# EasyEDA Pro project eLight_core.epro, schematic Schematic_v2
Board Name: eLight_core2; Create Date: 2024-08-03; Page Name: P1; Project Name: eLight_core; Schematic Name: Schematic2; Update Date: 2024-08-04; Company: 嘉立创EDA; Page Size: A4; Version: V1.0
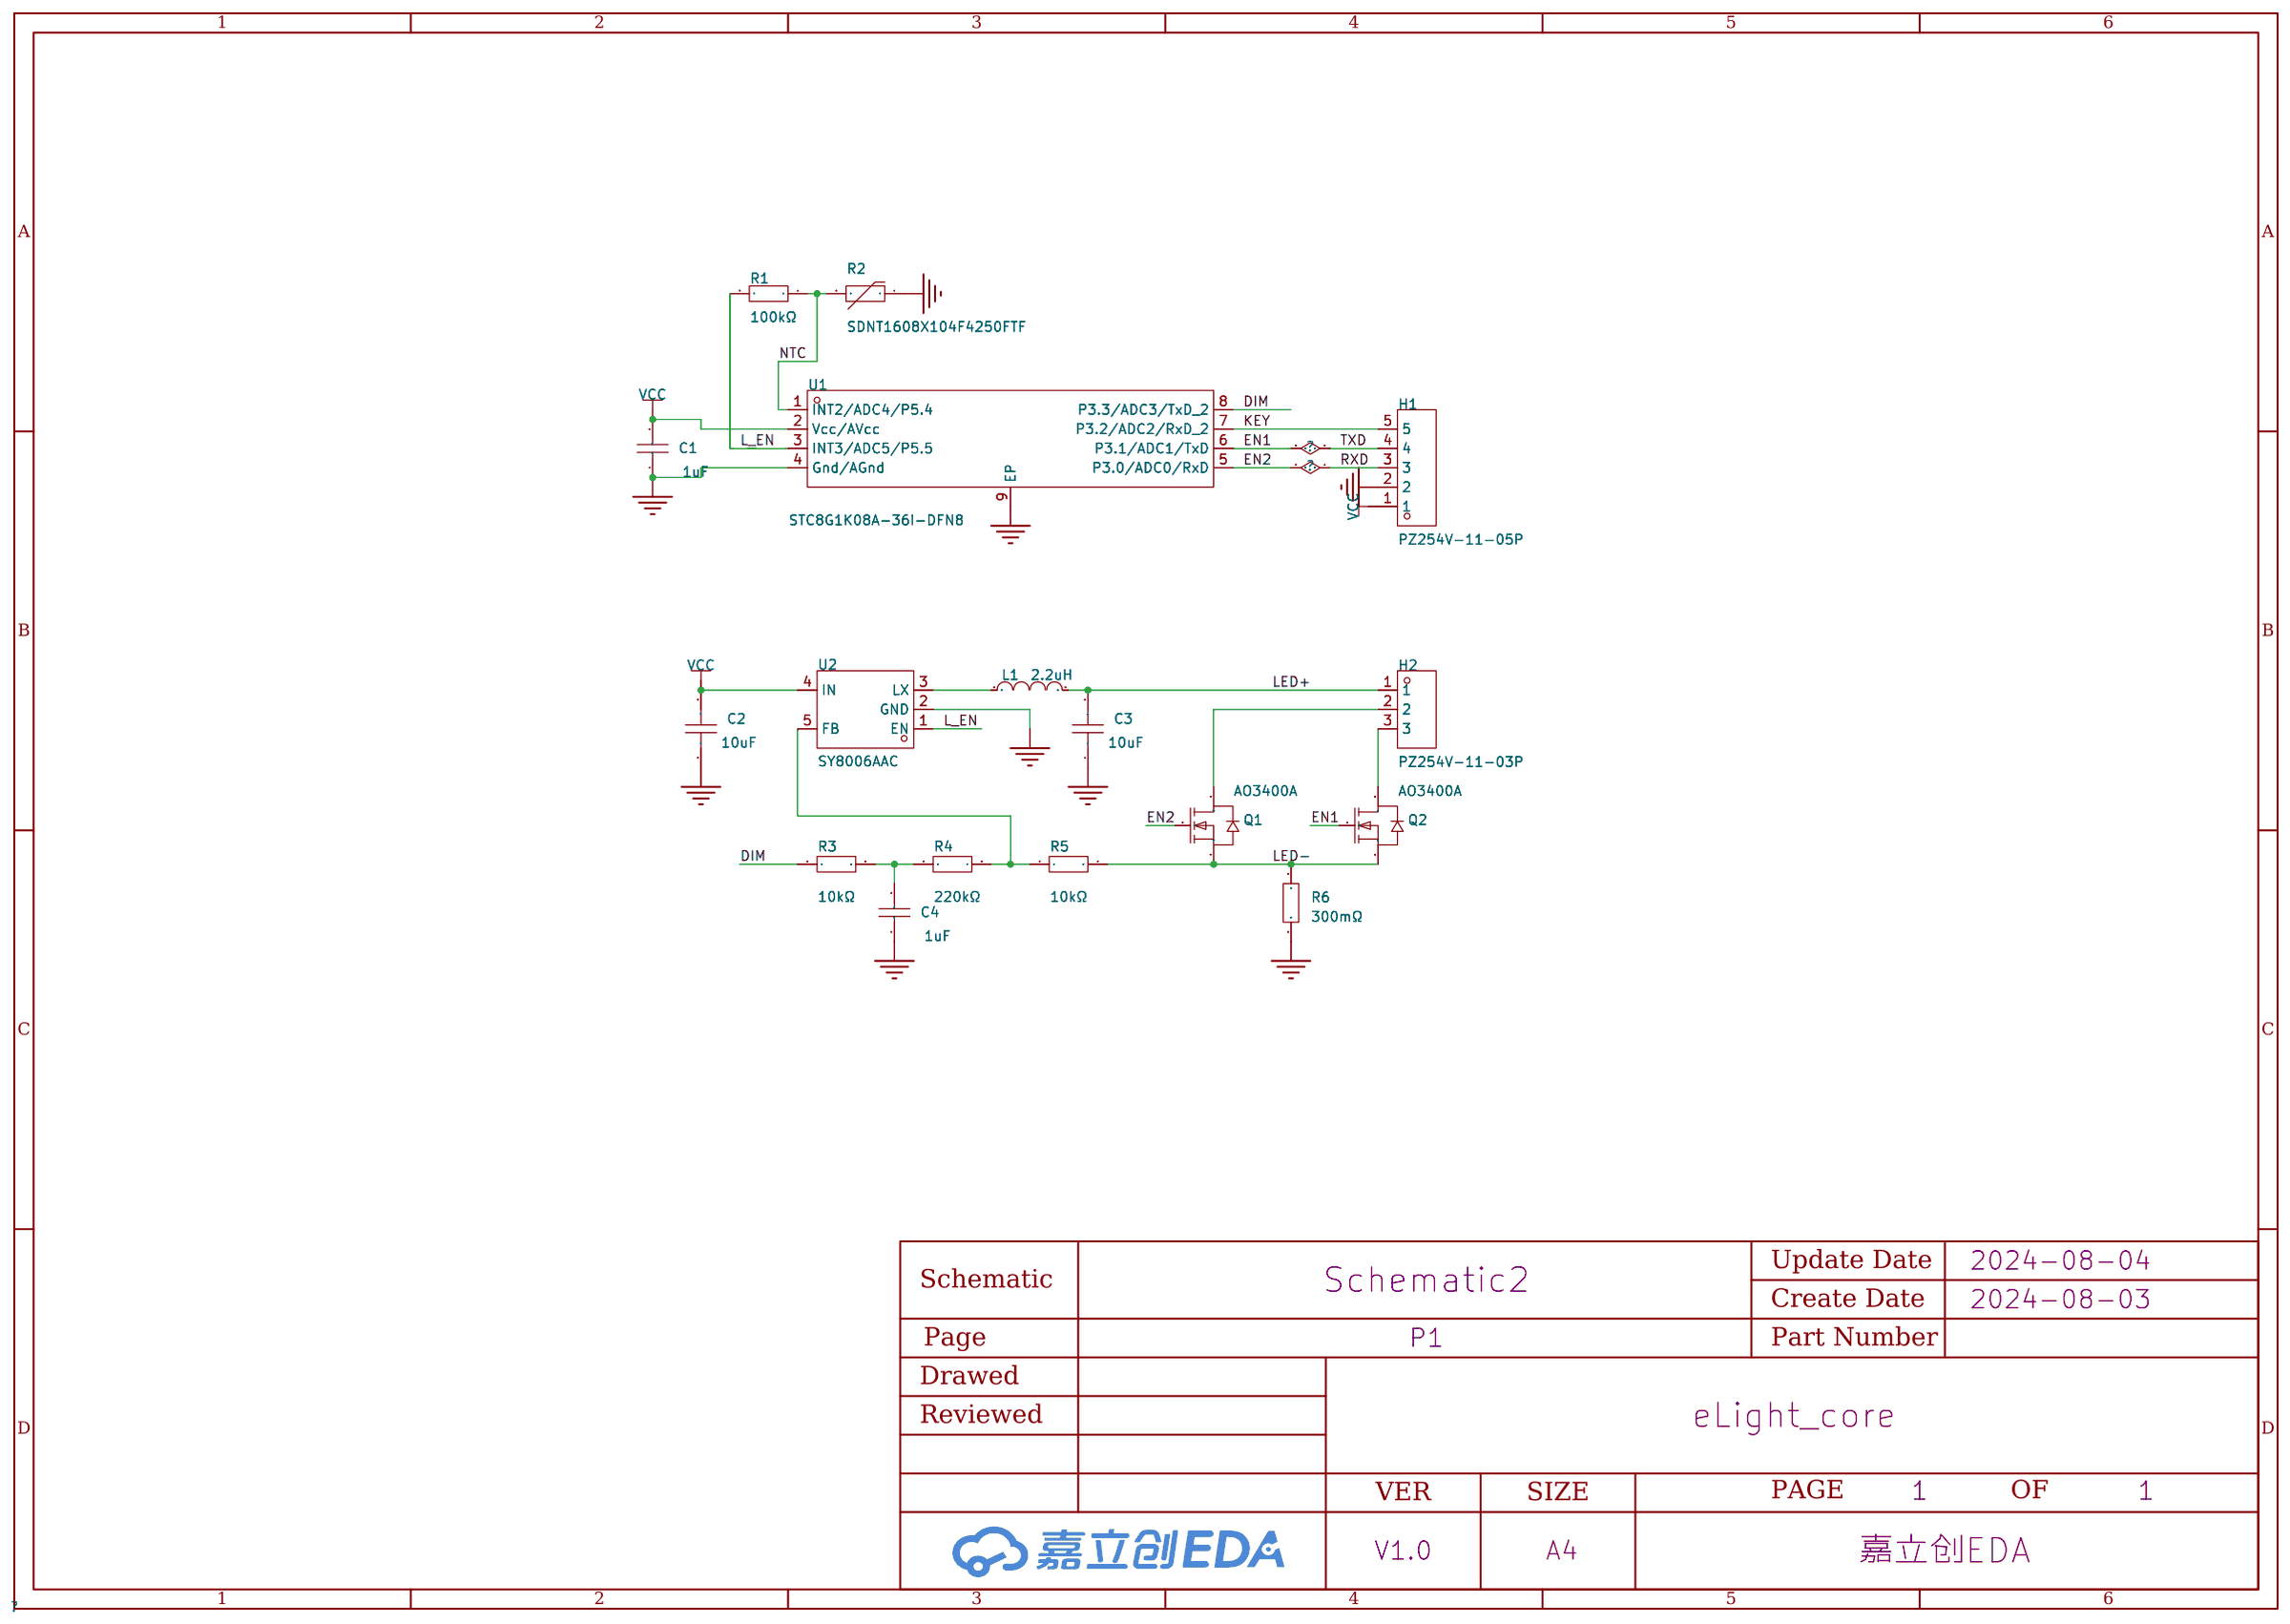
[diagram p3: schematic sheet]

## Parts
C1  1uF  [C0603]
C2  10uF  [C0603]
C3  10uF  [C0603]
C4  1uF  [C0603]
H1  PZ254V-11-05P  [HDR-TH_5P-P2.54-V-M]
H2  PZ254V-11-03P  [HDR-TH_3P-P2.54-V-M]
L1  2.2uH  [IND-SMD_L4.0-W4.0_LQH44PN2R2MP0L]
Q1  AO3400A  [SOT-23-3_L2.9-W1.3-P1.90-LS2.4-BR]
Q2  AO3400A  [SOT-23-3_L2.9-W1.3-P1.90-LS2.4-BR]
R1  100kΩ  [R0603]
R2  SDNT1608X104F4250FTF  [R0603]
R3  10kΩ  [R0603]
R4  220kΩ  [R0603]
R5  10kΩ  [R0603]
R6  300mΩ  [R0805]
U1  STC8G1K08A-36I-DFN8  [DFN-8_L3.0-W3.0-P0.50-BL-EP]
U2  SY8006AAC  [SOT-23-5_L3.0-W1.6-P0.95-LS2.8-BR]

## Library data of the parts
C1 C4 = CL10A105KB8NNNC: 容值:1uF;精度:±10%;额定电压:50V;材质(温度系数):X5R;; LCSC Part Name: 1uF ±10% 50V; Supplier Part: C15849; Manufacturer: SAMSUNG(三星); Supplier Footprint: 0603; JLCPCB Part Class: Basic Part; Datasheet: https://atta.szlcsc.com/upload/public/pdf/source/20160103/1457707679084.pdf; Supplier: LCSC; Tolerance: ±10%; Voltage Rated: 50V; Temperature Coefficient: X5R
C2 C3 = CL10A106KP8NNNC: 容值:10uF;精度:±10%;额定电压:10V;材质(温度系数):X5R;; LCSC Part Name: 10uF ±10% 10V; Supplier Part: C19702; Manufacturer: SAMSUNG(三星); Supplier Footprint: 0603; JLCPCB Part Class: Basic Part; Datasheet: https://atta.szlcsc.com/upload/public/pdf/source/20160103/1457707703378.pdf; Supplier: LCSC; Tolerance: ±10%; Voltage Rated: 10V; Temperature Coefficient: X5R
H1 = PZ254V-11-05P: 插针结构:1x5P;间距:2.54mm;行距:-;圆针/方针:方针;安装类型:直插;排数:单排;总PIN位数:5P;额定电流:-;额定电压:-;配合针长度:6mm;塑高:2.5mm;端接针长度:3mm;触头材质:黄铜;触头镀层:-;工作温度范围:-40℃~+105℃;颜色:黑色;; LCSC Part Name: 间距:2.54mm 1x5P 直插 方针; Supplier Part: C492404; Manufacturer: XFCN(兴飞); Supplier Footprint: 插件,P=2.54mm; JLCPCB Part Class: 扩展库; Datasheet: https://atta.szlcsc.com/upload/public/pdf/source/20200309/C492404_E51533260F8710EFF5D4617281164C1D.pdf; Supplier: LCSC; Pin Structure: 1x5P; Pitch: 2.54mm; Circluar Pins/Square Pins: 方针; Mounting Type: 直插; Number of Rows: 单排; Number of Pins: 5P; Length of Mating Pin: 6mm; Insulation Height: 2.5mm; Length of End Connection Pin: 3mm; Contact Material: 黄铜; Operating Temperature Range: -40℃~+105℃; Color: 黑色
H2 = PZ254V-11-03P: 插针结构:1x3P;间距:2.54mm;行距:-;圆针/方针:方针;安装类型:直插;排数:单排;总PIN位数:3P;额定电流:3A;额定电压:250V;配合针长度:6mm;塑高:2.5mm;端接针长度:3mm;工作温度范围:-40℃~+105℃;颜色:黑色;; LCSC Part Name: 间距:2.54mm 1x3P 直插 方针; Supplier Part: C2937625; Manufacturer: XFCN(兴飞); Supplier Footprint: 插件,P=2.54mm; JLCPCB Part Class: 扩展库; Datasheet: https://atta.szlcsc.com/upload/public/pdf/source/20200309/C492402_8335C3D49C4E4C618838D59BB1D024C1.pdf; Supplier: LCSC; Pin Structure: 1x3P; Pitch: 2.54mm; Circluar Pins/Square Pins: 方针; Mounting Type: 直插; Number of Rows: 单排; Number of Pins: 3P; Current Rating (Max): 3A; Voltage Rating (Max): 250V; Length of Mating Pin: 6mm; Insulation Height: 2.5mm; Length of End Connection Pin: 3mm; Operating Temperature Range: -40℃~+105℃; Color: 黑色
L1 = SMNR4020-2.2UH: 电感值:2.2uH;精度:±20%;额定电流:3.4A;饱和电流(Isat):3.4A;; LCSC Part Name: 2.2uH ±20% 3.4A; Supplier Part: C135262; Manufacturer: SXN(顺翔诺); Supplier Footprint: SMD,4x4x2mm; JLCPCB Part Class: 扩展库; Datasheet: https://atta.szlcsc.com/upload/public/pdf/source/20210812/995F2AD58C1C491532425584E325E086.pdf; Supplier: LCSC; Tolerance: ±20%; Rated Current: 3.4A; Saturation Current (Isat): 3.4A; DC Resistance (DCR): 46mΩ
Q1 Q2 = AO3400A_C347475: 类型:1个N沟道;漏源电压(Vdss):30V;连续漏极电流(Id):5.8A;功率(Pd):1.4W;导通电阻(RDS(on)@Vgs,Id):35mΩ@10V,5.8A;阈值电压(Vgs(th)@Id):1.4V@250uA;; LCSC Part Name: 1个N沟道 耐压:30V 电流:5.8A; Supplier Part: C347475; Manufacturer: UMW(友台半导体); Supplier Footprint: SOT-23; JLCPCB Part Class: 扩展库; Datasheet: https://atta.szlcsc.com/upload/public/pdf/source/20231109/50AB4FB4D66E55864F9B8D027B723C9A.pdf; Supplier: LCSC; Type: 1个N沟道; Drain Source Voltage (Vdss): 30V; Continuous Drain Current (Id): 5.8A; Power Dissipation (Pd): 1.4W; Drain Source On Resistance (RDS(on)@Vgs,Id): 35mΩ@10V,5.8A; Gate Threshold Voltage (Vgs(th)@Id): 1.4V@250uA; Total Gate Charge (Qg@Vgs): 12nC@4.5V; Input Capacitance (Ciss@Vds): 1.05nF@15V; Operating Temperature: -55℃~+150℃@(Tj)
R1 = 0603WAF1003T5E: 电阻类型:厚膜电阻;阻值:100kΩ;精度:±1%;功率:100mW;温度系数:±100ppm/℃;最大工作电压:75V;工作温度范围:-55℃~+155℃;; LCSC Part Name: 100kΩ ±1% 100mW; Supplier Part: C25803; Manufacturer: UNI-ROYAL(厚声); Supplier Footprint: 0603; JLCPCB Part Class: Basic Part; Datasheet: https://atta.szlcsc.com/upload/public/pdf/source/20200306/C422600_1E6D84923E4A46A82E41ADD87F860B5C.pdf; Supplier: LCSC; Type: 厚膜电阻; Tolerance: ±1%; Power(Watts): 100mW; Temperature Coefficient: ±100ppm/℃; Overload Voltage (Max): 75V; Operating Temperature Range: -55℃~+155℃
R2 = SDNT1608X104F4250FTF: 阻值(25℃):100kΩ;B值(25℃/50℃):4250K;电阻精度:±1%;功率:100mW;B值精度:±1%;最大稳态电流(25℃):100uA;; LCSC Part Name: 100kΩ 电阻精度:±1% 4250K; Supplier Part: C95955; Manufacturer: Sunlord(顺络); Supplier Footprint: 0603; JLCPCB Part Class: 扩展库; Datasheet: https://atta.szlcsc.com/upload/public/pdf/source/20210916/BF106A3565EDFEB141CB3E0EA3A661F8.pdf; Supplier: LCSC; Resistance @ 25℃: 100kΩ; B Constant (25℃/50℃): 4250K; Resistance Tolerance: ±1%; Power: 100mW; B Constant Tolerance: ±1%; Steady State Current (Max): 100uA; Operating Temperature: -55℃~+125℃
R3 R5 = 0603WAF1002T5E: 电阻类型:厚膜电阻;阻值:10kΩ;精度:±1%;功率:100mW;温度系数:±100ppm/℃;最大工作电压:75V;工作温度范围:-55℃~+155℃;; LCSC Part Name: 10kΩ ±1% 100mW; Supplier Part: C25804; Manufacturer: UNI-ROYAL(厚声); Supplier Footprint: 0603; JLCPCB Part Class: Basic Part; Datasheet: https://atta.szlcsc.com/upload/public/pdf/source/20200306/C422600_1E6D84923E4A46A82E41ADD87F860B5C.pdf; Supplier: LCSC; Type: 厚膜电阻; Tolerance: ±1%; Power(Watts): 100mW; Temperature Coefficient: ±100ppm/℃; Overload Voltage (Max): 75V; Operating Temperature Range: -55℃~+155℃
R4 = 0603WAF2203T5E: 电阻类型:厚膜电阻;阻值:220kΩ;精度:±1%;功率:100mW;温度系数:±100ppm/℃;最大工作电压:75V;工作温度范围:-55℃~+155℃;; LCSC Part Name: 220kΩ ±1% 100mW; Supplier Part: C22961; Manufacturer: UNI-ROYAL(厚声); Supplier Footprint: 0603; JLCPCB Part Class: Basic Part; Datasheet: https://atta.szlcsc.com/upload/public/pdf/source/20200306/C422600_1E6D84923E4A46A82E41ADD87F860B5C.pdf; Supplier: LCSC; Type: 厚膜电阻; Tolerance: ±1%; Power(Watts): 100mW; Temperature Coefficient: ±100ppm/℃; Overload Voltage (Max): 75V; Operating Temperature Range: -55℃~+155℃
R6 = 0805W8F300LT5E: 电阻类型:厚膜电阻;阻值:300mΩ;精度:±1%;功率:125mW;最大工作电压:150V;温度系数:±800ppm/℃;; LCSC Part Name: 300mΩ ±1% 125mW 厚膜电阻; Supplier Part: C247157; Manufacturer: UNI-ROYAL(厚声); Supplier Footprint: 0805; JLCPCB Part Class: 扩展库; Datasheet: https://atta.szlcsc.com/upload/public/pdf/source/20200306/C422600_1E6D84923E4A46A82E41ADD87F860B5C.pdf; Supplier: LCSC; Type: 厚膜电阻; Tolerance: ±1%; Power(Watts): 125mW; Overload Voltage (Max): 150V; Temperature Coefficient: ±800ppm/℃; Operating Temperature Range: -55℃~+155℃
U1 = STC8G1K08A-36I-DFN8: CPU内核:51系列;程序存储容量:8KB;GPIO端口数量:-;工作电压范围:-;CPU最大主频:-;程序存储器类型:FLASH;; Supplier Part: C915664; Manufacturer: STC(宏晶); Supplier Footprint: DFN-8-EP(3x3); JLCPCB Part Class: 扩展库; Datasheet: https://atta.szlcsc.com/upload/public/pdf/source/20230914/7707908C45C6343AE73767C1466DDB8D.pdf; Supplier: LCSC; CPU Core: 51系列; Program Storage Size: 8KB; Program Memory Type: FLASH; Internal Oscillator: 有
U2 = SY8006AAC: Supplier Part: C207635; Manufacturer: silergy(矽力杰); Supplier Footprint: SOT-23-5; JLCPCB Part Class: Extended Part; Datasheet: https://atta.szlcsc.com/upload/public/pdf/source/20220426/6B77E4D9F50C5AD910D0E0C02879B237.pdf; Supplier: LCSC

## Nets
GND: C1.1 C2.1 C3.1 C4.1 H1.2 R2.1 R6.1 U1.4(Gnd/AGnd) U1.9(EP) U2.2(GND)
VCC: C1.2 C2.2 H1.1 U1.2(Vcc/AVcc) U2.4(IN)
DIM: R3.1 U1.8(P3.3/ADC3/TxD_2)
EN1: H1.4 Q2.1(G) U1.6(P3.1/ADC1/TxD)
EN2: H1.3 Q1.1(G) U1.5(P3.0/ADC0/RxD)
KEY: H1.5 U1.7(P3.2/ADC2/RxD_2)
L_EN: R1.2 U1.3(INT3/ADC5/P5.5) U2.1(EN)
LED+: C3.2 H2.1 L1.2
LED-: Q1.2(S) Q2.2(S) R5.2 R6.2
NTC: R1.1 R2.2 U1.1(INT2/ADC4/P5.4)
$1N3190: L1.1 U2.3(LX)
$1N3207: H2.2 Q1.3(D)
$1N7267: H2.3 Q2.3(D)
$1N42712: R4.2 R5.1 U2.5(FB)
$1N42727: C4.2 R3.2 R4.1
